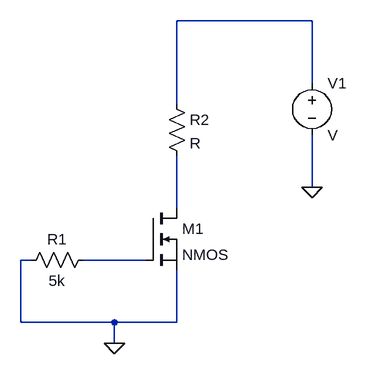
[diagram p0: schematic Draft3.asc]
Draft3.asc, the LTspice schematic file:
Version 4
SHEET 1 880 680
WIRE 368 -176 160 -176
WIRE 368 -80 368 -176
WIRE 160 -48 160 -176
WIRE 368 80 368 0
WIRE 160 112 160 32
WIRE -64 192 -80 192
WIRE 112 192 16 192
WIRE -80 288 -80 192
WIRE 64 288 -80 288
WIRE 160 288 160 208
WIRE 160 288 64 288
WIRE 64 320 64 288
FLAG 64 320 0
FLAG 368 80 0
SYMBOL nmos 112 112 R0
SYMATTR InstName M1
SYMBOL res 32 176 R90
WINDOW 0 0 56 VBottom 2
WINDOW 3 32 56 VTop 2
SYMATTR InstName R1
SYMATTR Value 5k
SYMBOL res 144 -64 R0
SYMATTR InstName R2
SYMBOL voltage 368 -96 R0
SYMATTR InstName V1

The netlist it stands for:
* Draft3.asc
M1 N002 N003 0 0 NMOS
R1 N003 0 5k
R2 N001 N002 R
V1 N001 0 V
.model NMOS NMOS
.model PMOS PMOS
.lib standard.mos
.backanno
.end